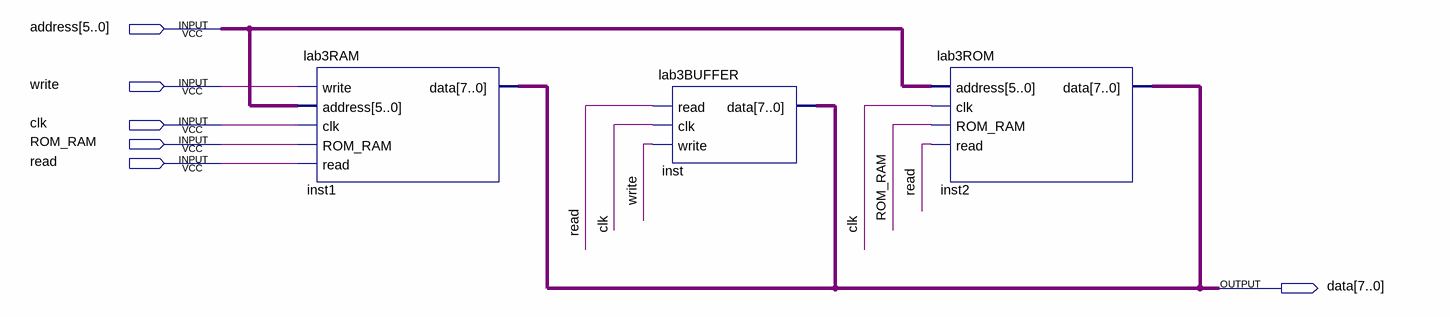
[diagram p0: schematic sheet]
// Quartus schematic lab3.bdf as structural Verilog: 3 symbols, 6 pins
module lab3 (
  input  [5:0] address,
  input  write,
  input  clk,
  input  ROM_RAM,
  input  read,
  output [7:0] data
);

  lab3RAM inst1 (.write(write), .address(address), .clk(clk), .ROM_RAM(ROM_RAM), .read(read), .data(data));
  lab3BUFFER inst (.read(read), .clk(clk), .write(write), .data(data));
  lab3ROM inst2 (.address(address), .clk(clk), .ROM_RAM(ROM_RAM), .read(read), .data(data));
endmodule
